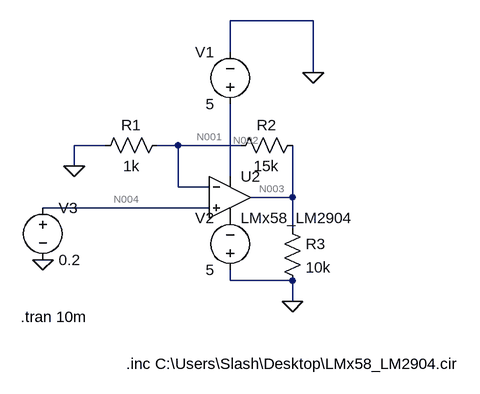
[diagram p0: schematic Draft1.asc]
Draft1.asc, the LTspice schematic file:
Version 4
SHEET 1 880 680
WIRE 384 -160 256 -160
WIRE 256 -112 256 -160
WIRE 384 -80 384 -160
WIRE 64 32 16 32
WIRE 176 32 144 32
WIRE 272 32 176 32
WIRE 16 64 16 32
WIRE 256 80 256 -32
WIRE 176 96 176 32
WIRE 224 96 176 96
WIRE 352 112 352 32
WIRE 352 112 288 112
WIRE 224 128 -32 128
WIRE 352 160 352 112
WIRE 256 240 256 224
WIRE 352 240 256 240
WIRE 352 272 352 240
FLAG 16 64 0
FLAG 352 272 0
FLAG 384 -80 0
FLAG -32 208 0
SYMBOL Opamps\\opamp2 256 48 R0
SYMATTR InstName U2
SYMATTR Value LMx58_LM2904
SYMBOL res 160 16 R90
WINDOW 0 0 56 VBottom 2
WINDOW 3 32 56 VTop 2
SYMATTR InstName R1
SYMATTR Value 1k
SYMBOL res 368 16 R90
WINDOW 0 0 56 VBottom 2
WINDOW 3 32 56 VTop 2
SYMATTR InstName R2
SYMATTR Value 15k
SYMBOL res 336 144 R0
SYMATTR InstName R3
SYMATTR Value 10k
SYMBOL voltage 256 -16 R180
WINDOW 0 24 96 Left 2
WINDOW 3 24 16 Left 2
WINDOW 123 0 0 Left 0
WINDOW 39 0 0 Left 0
SYMATTR InstName V1
SYMATTR Value 5
SYMBOL voltage 256 240 R180
WINDOW 0 24 96 Left 2
WINDOW 3 24 16 Left 2
WINDOW 123 0 0 Left 0
WINDOW 39 0 0 Left 0
SYMATTR InstName V2
SYMATTR Value 5
SYMBOL voltage -32 112 R0
WINDOW 123 0 0 Left 0
WINDOW 39 0 0 Left 0
SYMATTR InstName V3
SYMATTR Value 0.2
TEXT -66 296 Left 2 !.tran 10m
TEXT 96 368 Left 2 !.inc C:\\Users\\Slash\\Desktop\\LMx58_LM2904.cir

The netlist it stands for:
* Draft1.asc
XU2 N004 N001 N002 P001 N003 LMx58_LM2904  ; pins In+ In- V+ V- OUT
R1 N001 0 1k
R2 N003 N001 15k
R3 N003 0 10k
V1 N002 0 5
V2 0 P001 5
V3 N004 0 0.2
.tran 10m
.inc C:\Users\Slash\Desktop\LMx58_LM2904.cir
.backanno
.end

* Results of the author's LTspice run, read from the files saved beside the schematic
* Operating Point, zero values left out:
*   V(n003) = 3.234 V
*   V(n002) = 5 V
*   V(p001) = -5 V
*   V(n001) = 202.1 mV
*   V(n004) = 200 mV
*   I(R3) = 323.4 µA
*   I(R2) = 202.1 µA
*   I(R1) = 202.1 µA
*   I(V3) = 20 nA
*   I(V2) = -350 µA
*   I(V1) = -875.5 µA
*   Ix(u2:IN+) = -20 nA
*   Ix(u2:IN-) = -18 nA
*   Ix(u2:VCC) = 875.5 µA
*   Ix(u2:VEE) = -350 µA
*   Ix(u2:OUT) = -525.5 µA